# Altium schematic sheet PDInjector.SchDoc
size A4
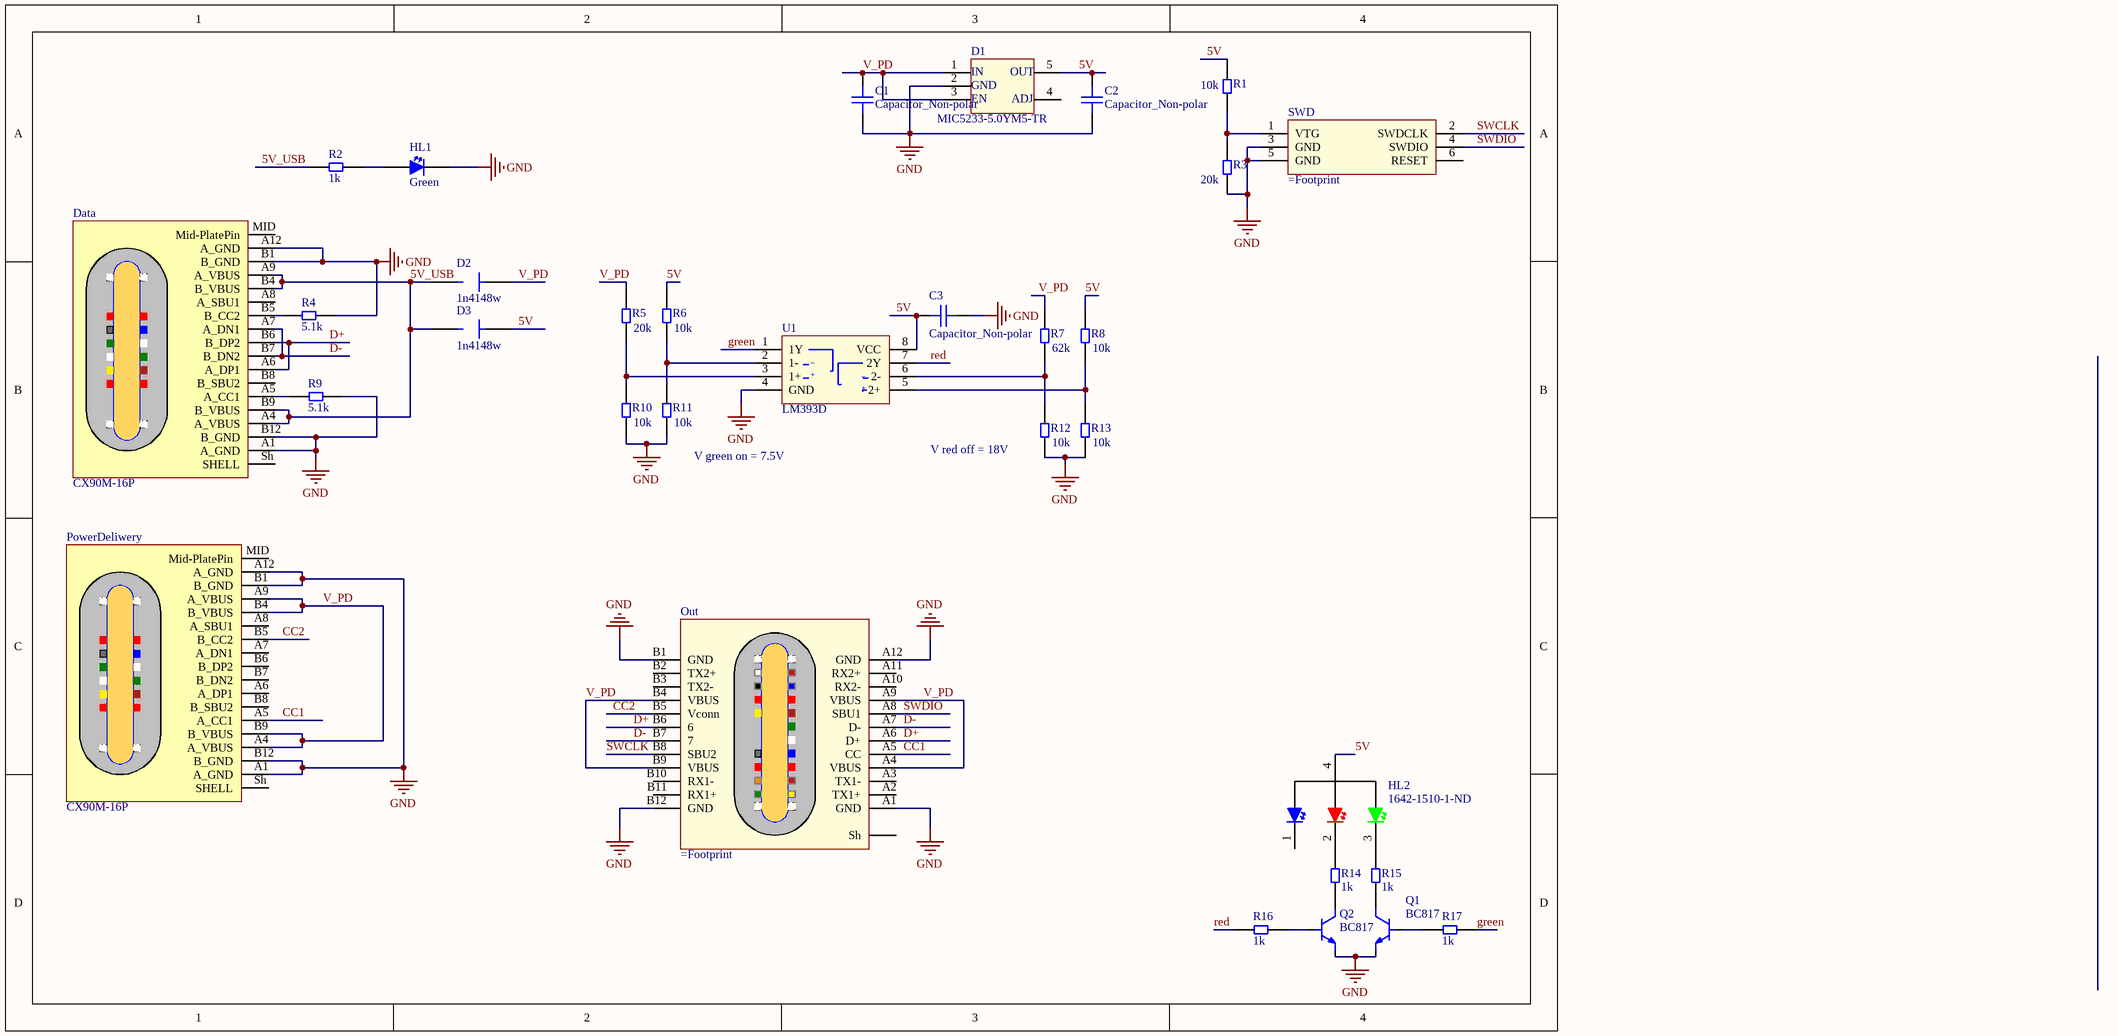
[diagram p0: PDInjector.SchDoc]

## Parts
C1  Capacitor_Non-polar  [CAP_0402]
C2  Capacitor_Non-polar  [CAP_0402]
C3  Capacitor_Non-polar  [CAP_0402]
D1  MIC5233-5.0YM5-TR  [SOT23-5]
D2  1n4148w  [SOD-123FL]
D3  1n4148w  [SOD-123FL]
Data  CX90M-16P  [USB_C_Hirose_CX90M-16P]
HL1  Green  [LED_0603]
HL2  1642-1510-1-ND  [CL-505S-X-SD-T]
Out  (no value)  [USB_TYPE-C_PLUG]
PowerDeliwery  CX90M-16P  [USB_C_Hirose_CX90M-16P]
Q1  BC817  [SOT23]
Q2  BC817  [SOT23]
R1  10k  [RES_0402]
R2  1k  [RES_0402]
R3  20k  [RES_0402]
R4  5.1k  [RES_0402]
R5  20k  [RES_0402]
R6  10k  [RES_0402]
R7  62k  [RES_0402]
R8  10k  [RES_0402]
R9  5.1k  [RES_0402]
R10  10k  [RES_0402]
R11  10k  [RES_0402]
R12  10k  [RES_0402]
R13  10k  [RES_0402]
R14  1k  [RES_0402]
R15  1k  [RES_0402]
R16  1k  [RES_0402]
R17  1k  [RES_0402]
SWD  (no value)  [MICRO-MATCH FOB.06P]
U1  LM393D  [SOIC8(3.9)]

## Nets
GND: C1.1 C2.1 C3.2 D1.2 Data.A1(A_GND) Data.A12(A_GND) Data.B1(B_GND) Data.B12(B_GND) HL1.2 Out.A1(GND) Out.A12(GND) Out.B1(GND) Out.B12(GND) PowerDeliwery.A1(A_GND) PowerDeliwery.A12(A_GND) PowerDeliwery.B1(B_GND) PowerDeliwery.B12(B_GND) Q1.2(E) Q2.2(E) R3.1 R4.1 R9.1 R10.1 R11.1 R12.1 R13.1 SWD.3(GND) SWD.5(GND) U1.4(GND)
5V: C2.2 C3.1 D1.5 D3.2(Cathode) HL2.4 R1.2 R6.2 R8.2 U1.8(VCC)
5V_USB: D2.1(Anode) D3.1(Anode) Data.A4(A_VBUS) Data.A9(A_VBUS) Data.B4(B_VBUS) Data.B9(B_VBUS) R2.2
CC1: Out.A5(CC) PowerDeliwery.A5(A_CC1)
CC2: Out.B5(Vconn) PowerDeliwery.B5(B_CC2)
D+: Data.A6(A_DP1) Data.B6(B_DP2) Out.A6(D+) Out.B6(6)
D-: Data.A7(A_DN1) Data.B7(B_DN2) Out.A7(D-) Out.B7(7)
green: R17.2 U1.1(1Y)
red: R16.1 U1.7(2Y)
SWCLK: Out.B8(SBU2) SWD.2(SWDCLK)
SWDIO: Out.A8(SBU1) SWD.4(SWDIO)
V_PD: C1.2 D1.1 D1.3 D2.2(Cathode) Out.A4(VBUS) Out.A9(VBUS) Out.B4(VBUS) Out.B9(VBUS) PowerDeliwery.A4(A_VBUS) PowerDeliwery.A9(A_VBUS) PowerDeliwery.B4(B_VBUS) PowerDeliwery.B9(B_VBUS) R5.2 R7.2
NetData_A5: Data.A5(A_CC1) R9.2
NetData_B5: Data.B5(B_CC2) R4.2
NetHL1_1: HL1.1 R2.1
NetHL2_2: HL2.2 R14.1
NetHL2_3: HL2.3 R15.1
NetQ1_1: Q1.1(B) R17.1
NetQ1_3: Q1.3(C) R15.2
NetQ2_1: Q2.1(B) R16.2
NetQ2_3: Q2.3(C) R14.2
NetR1_1: R1.1 R3.2 SWD.1(VTG)
NetR5_1: R5.1 R10.2 U1.3(1+)
NetR6_1: R6.1 R11.2 U1.2(1-)
NetR7_1: R7.1 R12.2 U1.6(2-)
NetR8_1: R8.1 R13.2 U1.5(2+)

Not connected (* = marked no-connect by the designer): D1 4; Data A8(A_SBU1) B8(B_SBU2) MID(Mid-PlatePin) Sh(SHELL); HL2 1; Out A2(TX1+) A3(TX1-) A10(RX2-) A11(RX2+) B2(TX2+) B3(TX2-) B10(RX1-) B11(RX1+) Sh; PowerDeliwery A6(A_DP1) A7(A_DN1) A8(A_SBU1) B6(B_DP2) B7(B_DN2) B8(B_SBU2) MID(Mid-PlatePin) Sh(SHELL); SWD 6(RESET)

## Notes on the sheet
- V green on = 7.5V
- (near R12) V red off = 18V
- (in symbol LM358) _; +
- (in symbol MIC5233-3.3YM5-TR LDO) IN; OUT; GND; EN; ADJ

## Library data of the parts
D1 = MIC5233-3.3YM5-TR LDO
D2 D3 = DIOD: Different types of diodes
Data PowerDeliwery = USB_C_Hirose_CX90M-16P: USB-C (USB TYPE-C) USB 3.2 Gen 2 (USB 3.1 Gen 2, Superspeed + (USB 3.1)) Receptacle Connector 24 (16+8 Dummy) Position Board Edge, Cutout; Surface Mount; Through Hole, Right Angle
HL1 = SMD_LED
HL2 = 1642-1510-1-ND: Red, Green, Blue (RGB) 615nm Red, 530nm Green, 470nm Blue LED Indication - Discrete 1.85V Red, 2.7V Green, 2.75V Blue 0404 (1010 Metric)
Out = USB Type-C Plug
Q1 Q2 = Transistor_NPN_SOT-23
R1-R17 = Resistor
SWD = MICRO-MATCH FOB.06P_nRF/STM32_SWD
U1 = LM358: Dual OpAmp